# Altium schematic sheet 100068622_rail_discharge.SchDoc
size 863 x 558 mm; SheetNumber: 6; SheetTotal: 6
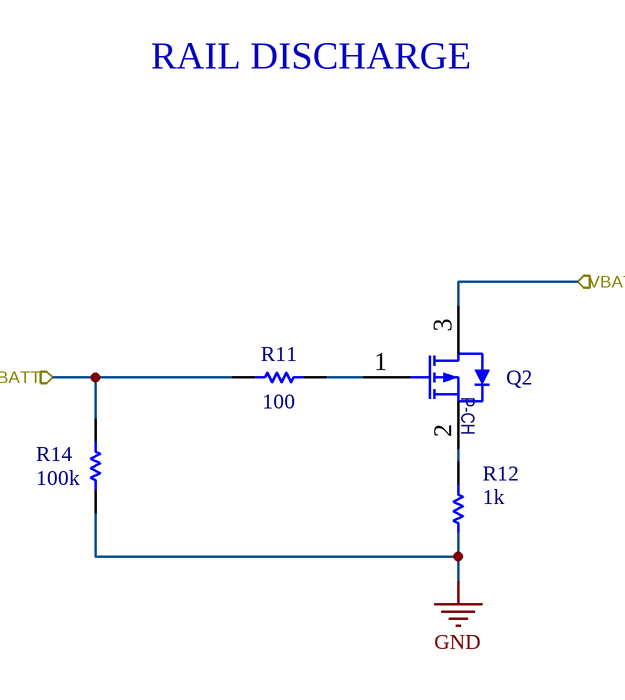
[diagram p0: 100068622_rail_discharge.SchDoc]

## Parts
Q2  DMP610DL-13  [IC-SOT23-3-A]  (value not drawn)
R11  value 100  [RES-0402-B]  (hidden comment: Res 0402 100 Ohm 0.1W 1% Thick Film)
R12  value 1k  [RES-2512-C]  (hidden comment: Resistor)
R14  value 100k  [RES-0402-C]  (hidden comment: Res 0402 100K 1/10W 1% Thick Flim)

## Ports
VBATT (in), VBATT_PROT (in)

## Nets
GND: R12.1 R14.1
VBATT: R11.2 R14.2 ; port VBATT
VBATT_PROT: Q2.3(D) ; port VBATT_PROT
NetQ2_1: Q2.1(G) R11.1
NetQ2_2: Q2.2(S) R12.2

## Notes on the sheet
- RAIL DISCHARGE
- DWG NO
- REVISIONS
- SH
- REVISION
- DESCRIPTION
- DATE(YEAR-MO-DA)
- APPROVED
- PART NO.
- DESIGN ACTIVITY
- US ARMY
  COMBAT CAPABILITIES DEVELOPMENT COMMAND ARMAMENTS CENTER
  PICATINNY ARSENAL, NEW JERSEY 07806-5000
- SIZE
- CAGE CODE
- DWG NO.
- D
- 19200
- SCALE
- NONE
- UNIT WT.
- ---
- SHEET
- (in symbol CMP-00655-1) P-CH

## Library data of the parts
Q2 = CMP-00655-1: Trans Mosfet P-ch 60V 0.18A 3-PIN SOT-23 T/r; Continuous Drain Current (ID): 180mA; Drain to Source Resistance: 10Ω; Number of Elements: 1; Power Dissipation: 500mW; Footprint: Package_TO_SOT_SMD:SOT-23; China RoHS: Compliant; Country of Origin: Mainland China; Export Control Classification Number (ECCN) Code: EAR99; Harmonized Tariff Schedule (HTS) Code: 8541.21.00.95; Introduction Date: 2018-02-27; Lifecycle Status: Production; Max Operating Temperature: 150°C; Min Breakdown Voltage: 60V; Min Operating Temperature: -55°C; Number of Terminals: 3; REACH SVHC: Yes; RoHS: Compliant
R11 = RES-00021-9: Power: 100mW; Voltage Rating: 100V; Footprint: Resistor_SMD:R_0402_1005Metric; Case/Package: 0402; Leader Qty: 100; Max Operating Temperature: 155°C; Min Operating Temperature: -55°C; Mounting Technology: SMD; Pins: 2; Tolerance: 1%
R12 = RES-00796-1: Res Thick Film 2512 1K Ohm 1% 1W ±100ppm/C Pad SMD T/R Automotive AEC-Q200; Leader Qty: 100; UOM: EA; Voltage Rating: 200V; Footprint: 1a_CommonPassives:R_2512_HandSoldering; Case/Package: 2512; Composition: Thick Film; Height: 600µm; Lifecycle Status: Production; Max Operating Temperature: 155°C; Min Operating Temperature: -55°C; Mounting Technology: Surface Mount; Power Rating: 1W; Working Voltage: 200V
R14 = RES-00031-9: Leader Qty: 100; Footprint: Resistor_SMD:R_0402_1005Metric; Case/Package: 0402; Max Operating Temperature: 155°C; Min Operating Temperature: -55°C; Mounting Technology: SMT; Pins: 2; RoHS Compliant: Yes; Tolerance: 1%